# Altium schematic sheet Res_Adjustment.SchDoc
size A4
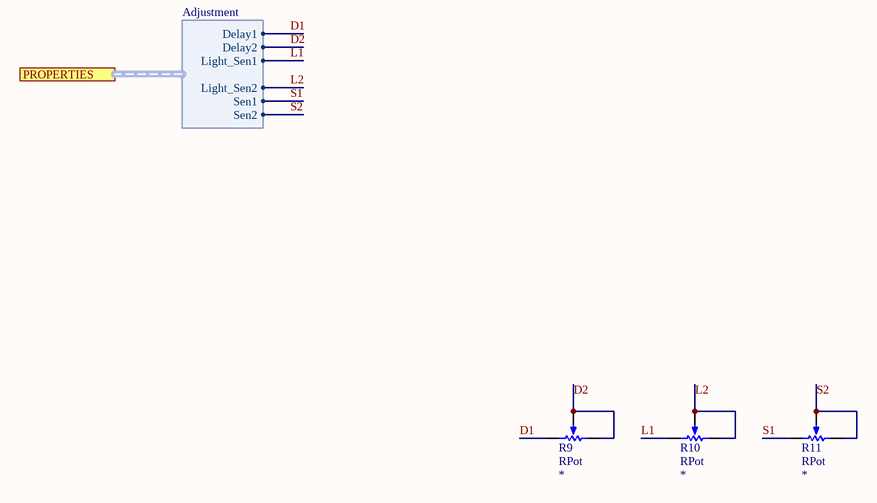
[diagram p0: Res_Adjustment.SchDoc]

## Parts
R9  RPot  [VR3362P]
R10  RPot  [VR3362P]
R11  RPot  [VR3362P]

## Ports
PROPERTIES (harness Adjustment)

## Harnesses
Adjustment: Delay1, Delay2, Light_Sen1, Light_Sen2, Sen1, Sen2

## Nets
D1: R9.3(BOT) ; port PROPERTIES.Delay1
D2: R9.1(TOP) R9.2(TAP) ; port PROPERTIES.Delay2
L1: R10.3(BOT) ; port PROPERTIES.Light_Sen1
L2: R10.1(TOP) R10.2(TAP) ; port PROPERTIES.Light_Sen2
S1: R11.3(BOT) ; port PROPERTIES.Sen1
S2: R11.1(TOP) R11.2(TAP) ; port PROPERTIES.Sen2

## Library data of the parts
R9-R11 = RPot: Potentiometer; Res: *